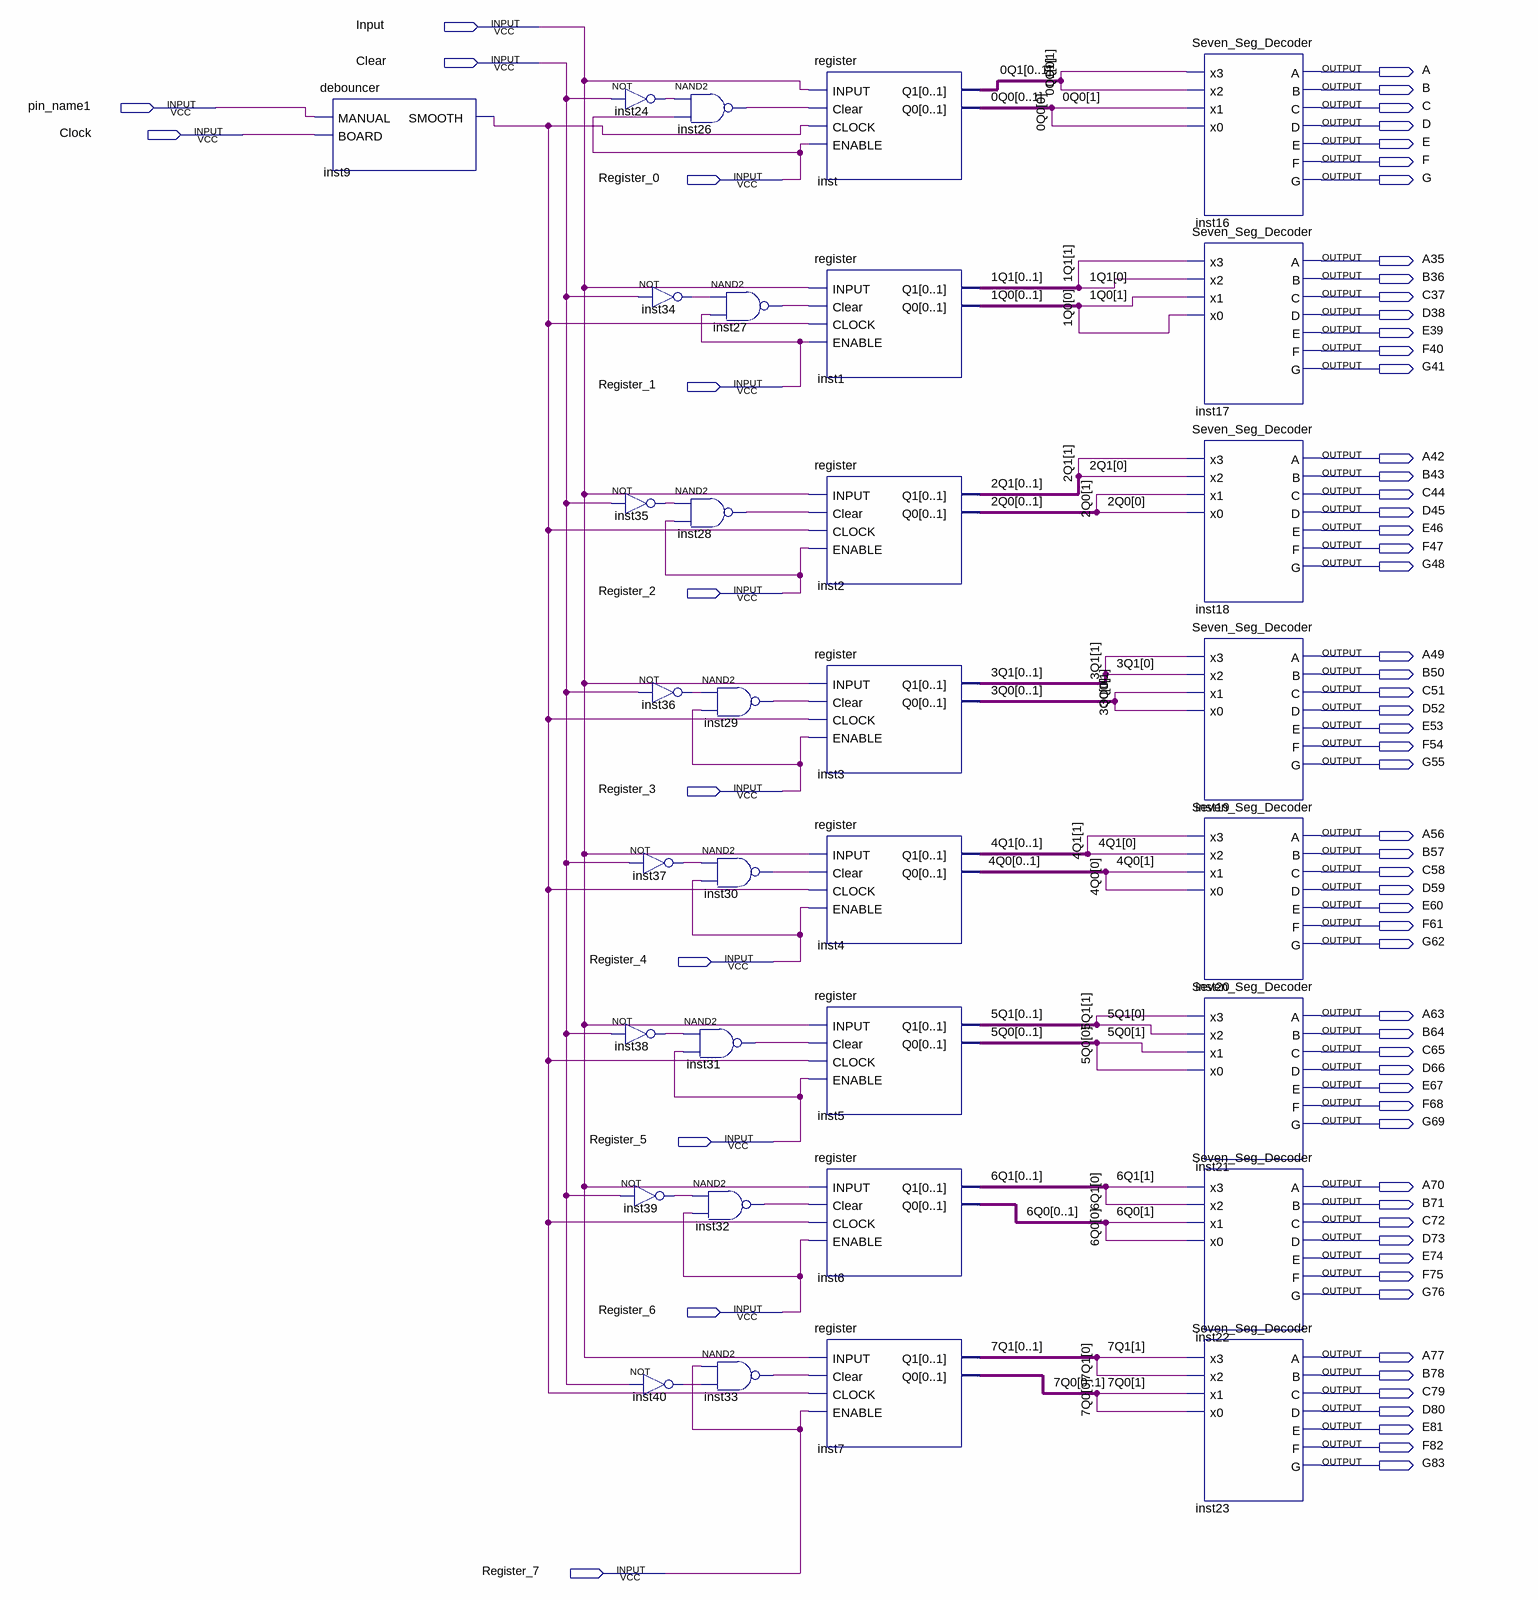
[diagram p0: schematic sheet]
// Quartus schematic stepC.bdf as structural Verilog: 33 symbols, 68 pins
module stepC (
  input  Input,
  input  Clear,
  input  pin_name1,
  input  Clock,
  input  Register_0,
  input  Register_1,
  input  Register_2,
  input  Register_3,
  input  Register_4,
  input  Register_5,
  input  Register_6,
  input  Register_7,
  output A,
  output B,
  output C,
  output D,
  output E,
  output F,
  output G,
  output A35,
  output B36,
  output C37,
  output D38,
  output E39,
  output F40,
  output G41,
  output A42,
  output B43,
  output C44,
  output D45,
  output E46,
  output F47,
  output G48,
  output A49,
  output B50,
  output C51,
  output D52,
  output E53,
  output F54,
  output G55,
  output A56,
  output B57,
  output C58,
  output D59,
  output E60,
  output F61,
  output G62,
  output A63,
  output B64,
  output C65,
  output D66,
  output E67,
  output F68,
  output G69,
  output A70,
  output B71,
  output C72,
  output D73,
  output E74,
  output F75,
  output G76,
  output A77,
  output B78,
  output C79,
  output D80,
  output E81,
  output F82,
  output G83
);

  wire inst9_smooth, inst24_out, inst26_out, inst27_out, inst28_out, inst29_out, inst30_out, inst31_out,
       inst32_out, inst33_out, inst34_out, inst35_out, inst36_out, inst37_out, inst38_out, inst39_out,
       inst40_out;
  wire [1:0] \0Q0 , \0Q1 , \1Q0 , \1Q1 , \2Q0 , \2Q1 , \3Q0 , \3Q1 , \4Q0 , \4Q1 , \5Q0 , \5Q1 , \6Q0 ,
       \6Q1 , \7Q0 , \7Q1 ;

  debouncer inst9 (.MANUAL(pin_name1), .BOARD(Clock), .SMOOTH(inst9_smooth));
  not inst24 (inst24_out, Clear);
  not inst34 (inst34_out, Clear);
  not inst35 (inst35_out, Clear);
  not inst36 (inst36_out, Clear);
  not inst37 (inst37_out, Clear);
  not inst38 (inst38_out, Clear);
  not inst39 (inst39_out, Clear);
  not inst40 (inst40_out, Clear);
  nand inst26 (inst26_out, inst24_out, Register_0);
  nand inst27 (inst27_out, inst34_out, Register_1);
  nand inst28 (inst28_out, inst35_out, Register_2);
  nand inst29 (inst29_out, inst36_out, Register_3);
  nand inst30 (inst30_out, inst37_out, Register_4);
  nand inst31 (inst31_out, inst38_out, Register_5);
  nand inst32 (inst32_out, inst39_out, Register_6);
  nand inst33 (inst33_out, Register_7, inst40_out);
  register inst (
    .INPUT(Input), .Clear(inst26_out), .CLOCK(inst9_smooth), .ENABLE(Register_0), .Q1({\0Q1 [0], \0Q1 [1]}),
    .Q0({\0Q0 [0], \0Q0 [1]}));
  register inst1 (
    .INPUT(Input), .Clear(inst27_out), .CLOCK(inst9_smooth), .ENABLE(Register_1), .Q1({\1Q1 [0], \1Q1 [1]}),
    .Q0({\1Q0 [0], \1Q0 [1]}));
  register inst2 (
    .INPUT(Input), .Clear(inst28_out), .CLOCK(inst9_smooth), .ENABLE(Register_2), .Q1({\2Q1 [0], \2Q1 [1]}),
    .Q0({\2Q0 [0], \2Q0 [1]}));
  register inst3 (
    .INPUT(Input), .Clear(inst29_out), .CLOCK(inst9_smooth), .ENABLE(Register_3), .Q1({\3Q1 [0], \3Q1 [1]}),
    .Q0({\3Q0 [0], \3Q0 [1]}));
  register inst4 (
    .INPUT(Input), .Clear(inst30_out), .CLOCK(inst9_smooth), .ENABLE(Register_4), .Q1({\4Q1 [0], \4Q1 [1]}),
    .Q0({\4Q0 [0], \4Q0 [1]}));
  register inst5 (
    .INPUT(Input), .Clear(inst31_out), .CLOCK(inst9_smooth), .ENABLE(Register_5), .Q1({\5Q1 [0], \5Q1 [1]}),
    .Q0({\5Q0 [0], \5Q0 [1]}));
  register inst6 (
    .INPUT(Input), .Clear(inst32_out), .CLOCK(inst9_smooth), .ENABLE(Register_6), .Q1({\6Q1 [0], \6Q1 [1]}),
    .Q0({\6Q0 [0], \6Q0 [1]}));
  register inst7 (
    .INPUT(Input), .Clear(inst33_out), .CLOCK(inst9_smooth), .ENABLE(Register_7), .Q1({\7Q1 [0], \7Q1 [1]}),
    .Q0({\7Q0 [0], \7Q0 [1]}));
  Seven_Seg_Decoder inst16 (
    .x3(\0Q1 [1]), .x2(\0Q1 [0]), .x1(\0Q0 [1]), .x0(\0Q0 [0]), .A(A), .B(B), .C(C), .D(D), .E(E), .F(F),
    .G(G));
  Seven_Seg_Decoder inst17 (
    .x3(\1Q1 [1]), .x2(\1Q1 [0]), .x1(\1Q0 [1]), .x0(\1Q0 [0]), .A(A35), .B(B36), .C(C37), .D(D38), .E(E39),
    .F(F40), .G(G41));
  Seven_Seg_Decoder inst18 (
    .x3(\2Q1 [1]), .x2(\2Q1 [0]), .x1(\2Q0 [1]), .x0(\2Q0 [0]), .A(A42), .B(B43), .C(C44), .D(D45), .E(E46),
    .F(F47), .G(G48));
  Seven_Seg_Decoder inst19 (
    .x3(\3Q1 [1]), .x2(\3Q1 [0]), .x1(\3Q0 [1]), .x0(\3Q0 [0]), .A(A49), .B(B50), .C(C51), .D(D52), .E(E53),
    .F(F54), .G(G55));
  Seven_Seg_Decoder inst20 (
    .x3(\4Q1 [1]), .x2(\4Q1 [0]), .x1(\4Q0 [1]), .x0(\4Q0 [0]), .A(A56), .B(B57), .C(C58), .D(D59), .E(E60),
    .F(F61), .G(G62));
  Seven_Seg_Decoder inst21 (
    .x3(\5Q1 [1]), .x2(\5Q1 [0]), .x1(\5Q0 [1]), .x0(\5Q0 [0]), .A(A63), .B(B64), .C(C65), .D(D66), .E(E67),
    .F(F68), .G(G69));
  Seven_Seg_Decoder inst22 (
    .x3(\6Q1 [1]), .x2(\6Q1 [0]), .x1(\6Q0 [1]), .x0(\6Q0 [0]), .A(A70), .B(B71), .C(C72), .D(D73), .E(E74),
    .F(F75), .G(G76));
  Seven_Seg_Decoder inst23 (
    .x3(\7Q1 [1]), .x2(\7Q1 [0]), .x1(\7Q0 [1]), .x0(\7Q0 [0]), .A(A77), .B(B78), .C(C79), .D(D80), .E(E81),
    .F(F82), .G(G83));
endmodule
